# Altium project CM5_GPIO.PrjPcb
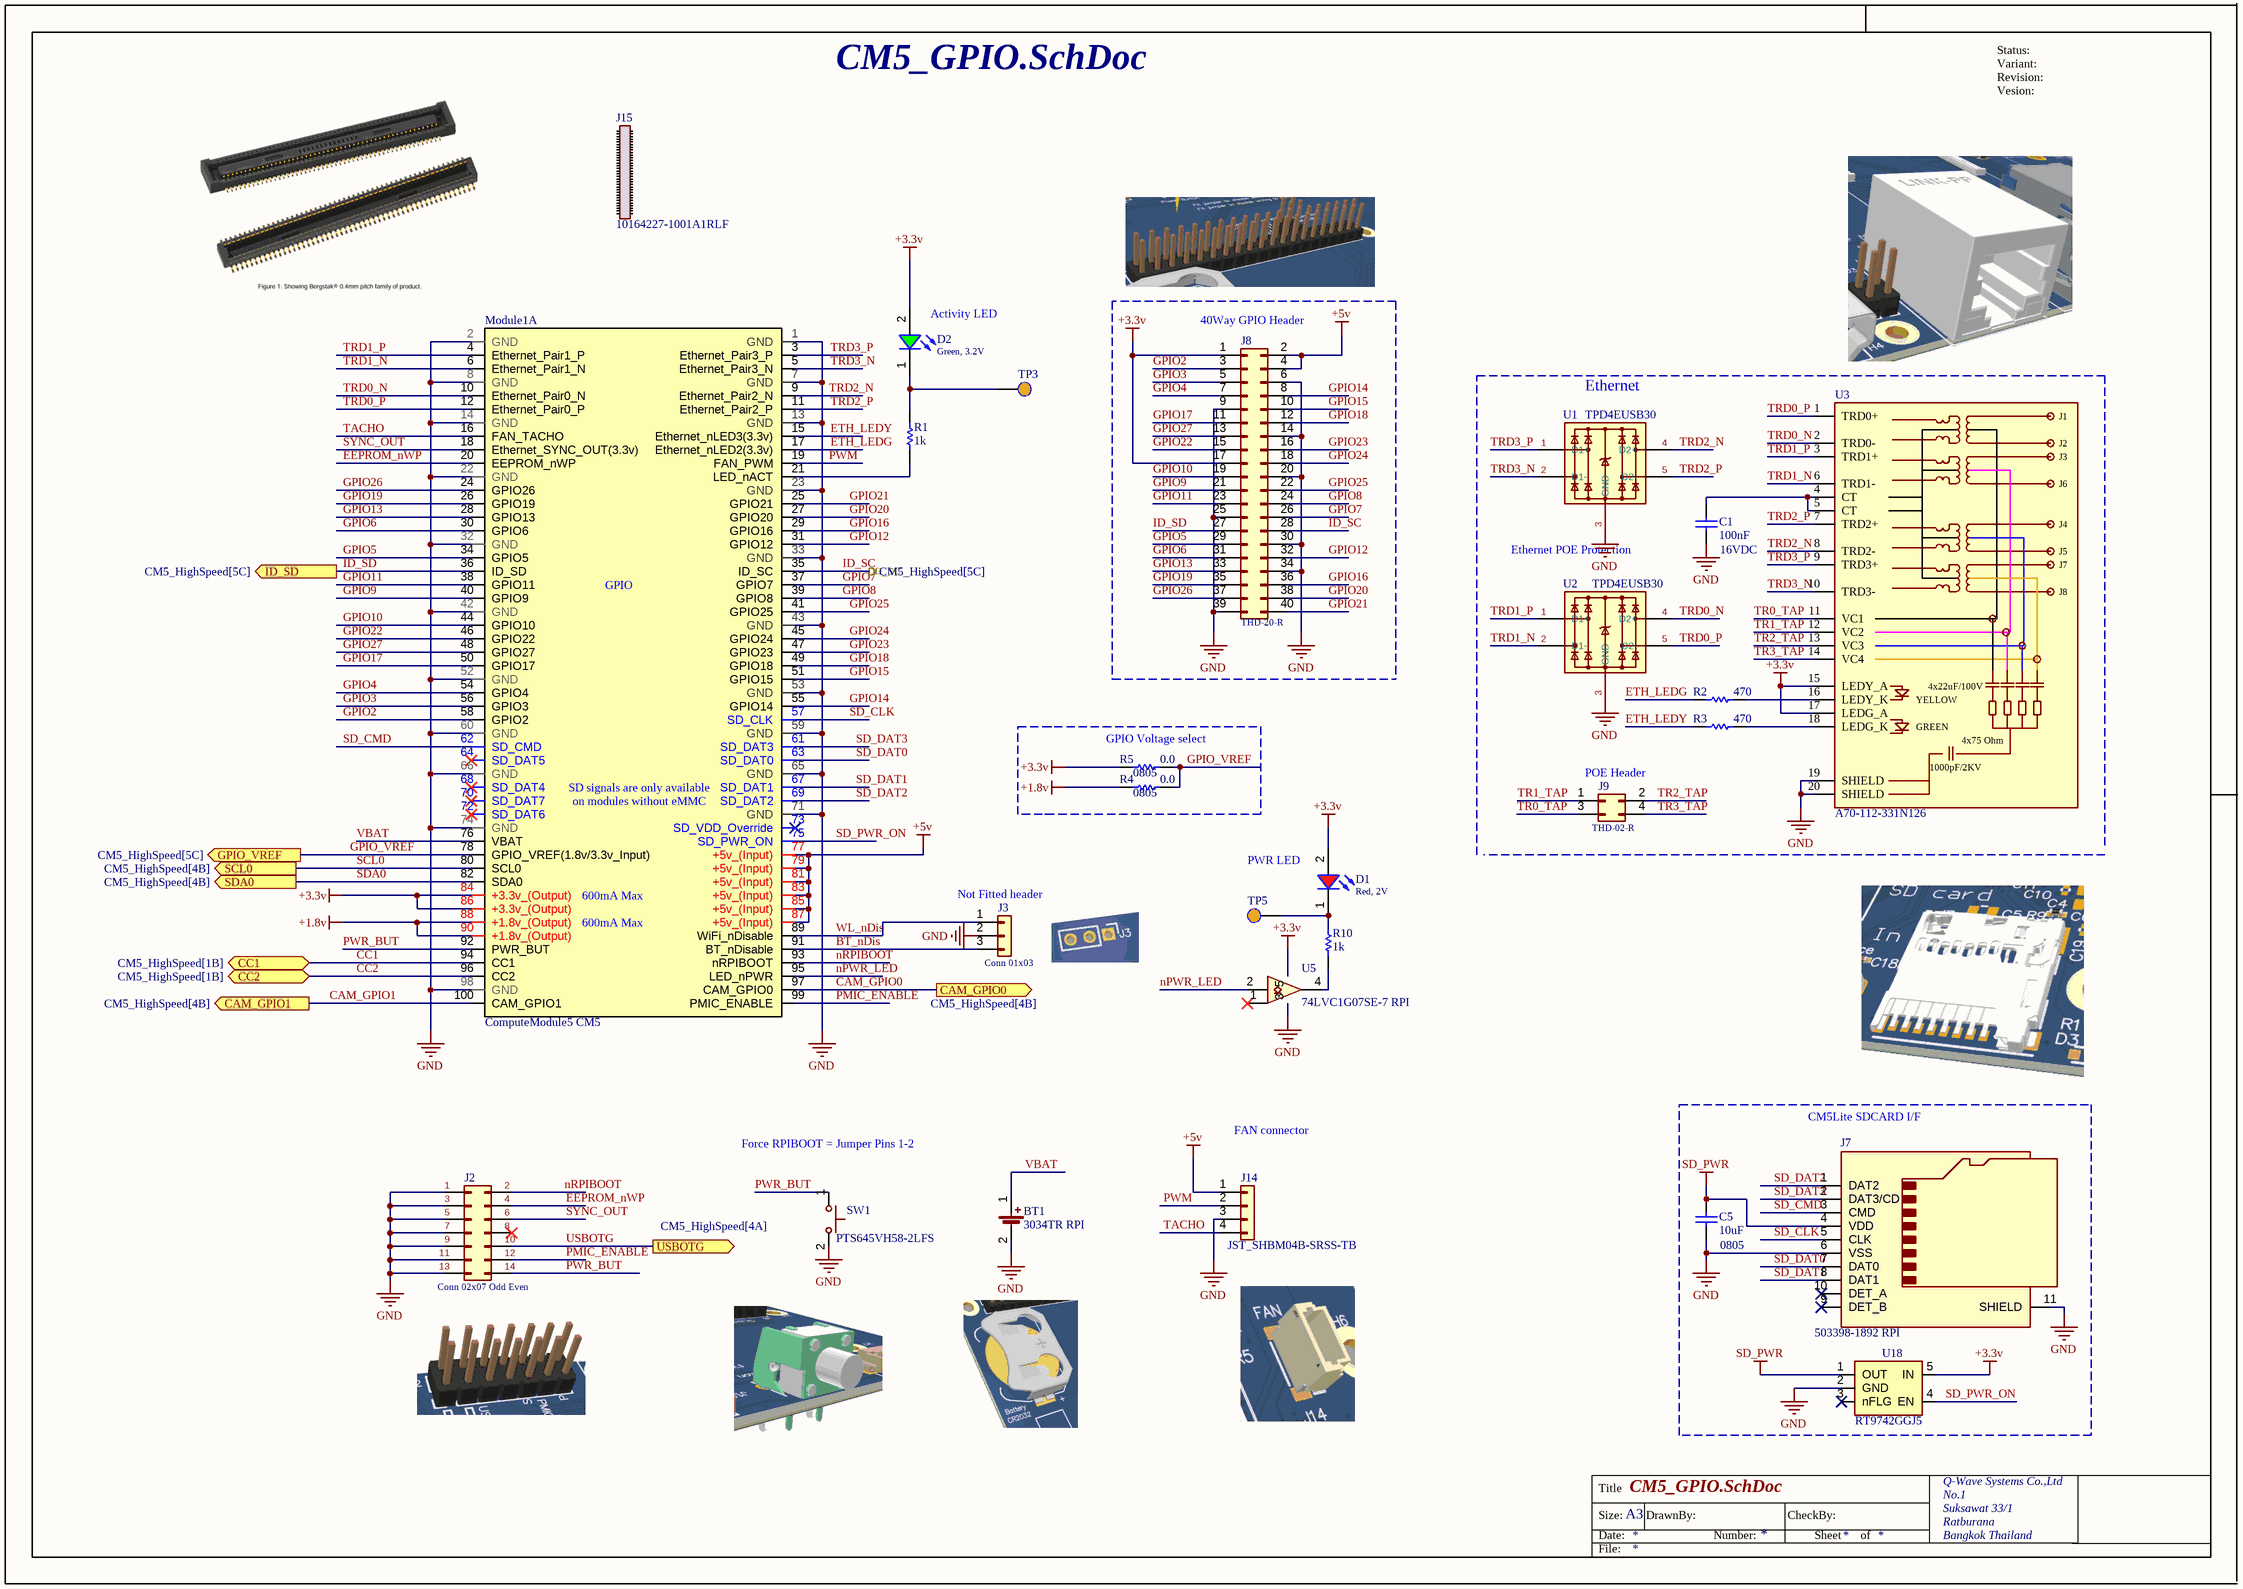
[diagram p0: CM5_GPIO.SchDoc]
3 sheets, 82 parts. Net scope: flat (ports and power ports of the same name join across sheets).
Board files: CM5IO.PcbDoc, CM5IO(1).PcbDoc
Sheets:
  CM5_GPIO.SchDoc
  CM5_HighSpeed.SchDoc
  PCIe-M2.SchDoc

## Sheet CM5_GPIO.SchDoc
size 420 x 297 mm; Organization: Q-Wave Systems Co.,Ltd; Address1: No.1; Address2: Suksawat 33/1; Address3: Ratburana; Address4: Bangkok Thailand

### Parts
BT1  3034TR RPI  [3034TR RPI]
C1  value 100nF  Rated Voltage: 16VDC  [WCAP-CSGP_0402_H=0.5mm]  (hidden comment: 100nF, 16V)
C5  value 10uF  Size: 0805  [WCAP-CSGP_0805_H=1.25mm]  (hidden comment: 10uF, 16V)
D1  Red, 2V  [WL-SMCW_0603_H=0.7mm_Red]
D2  Green, 3.2V  [WL-SMCW_0603_H=0.7mm_Green]
J2  Conn 02x07 Odd Even  [Conn 02x07 Odd Even]
J3  Conn 01x03  [Conn 01x03]
J7  503398-1892 RPI  [503398-1892 RPI]
J8  THD-20-R  [THD-20-R]
J9  THD-02-R  [THD-02-R]
J14  JST_SHBM04B-SRSS-TB  [JST_SHBM04B-SRSS-TB]
J15  10164227-1001A1RLF  [CM5-BergStak-10164227]
Module1  ComputeModule5 CM5  [ComputeModule5-CM5]  (part A of 2)  (no BOM)
R1  value 1k  [SMD-0402-RES]  (hidden comment: RES SMD 1K OHM 1% 1/10W 0402)
R2  value 470  [SMD-0402-RES]  (hidden comment: RES SMD 470 OHM 1% 1/10W 0402)
R3  value 470  [SMD-0402-RES]  (hidden comment: RES SMD 470 OHM 1% 1/10W 0402)
R4  value 0.0  Supplier Device Package: 0805  [SMD-0805-RES]  (hidden comment: ERJ-6GEY0R00V)
R5  value 0.0  Supplier Device Package: 0805  [SMD-0805-RES]  (hidden comment: ERJ-6GEY0R00V)
R10  value 1k  [SMD-0402-RES]  (hidden comment: RES SMD 1K OHM 1% 1/10W 0402)
SW1  PTS645VH58-2LFS  [PTS645VH58-2LFS]
TP3  TEST_POINT 1  [TEST_POINT 1]  (value not drawn)  (no BOM)
TP5  TEST_POINT 1  [TEST_POINT 1]  (value not drawn)  (no BOM)
U1  TPD4EUSB30  [TPD4EUSB30]
U2  TPD4EUSB30  [TPD4EUSB30]
U3  A70-112-331N126  [A70-112-331N126]
U5  74LVC1G07SE-7 RPI  [74LVC1G07SE-7 RPI]
U18  RT9742GGJ5  [FP-RT9742GGJ5-IPC_A]

### Blocks framed on the sheet
40Way GPIO Header: J8
GPIO Voltage select: R4 R5
CM5Lite SDCARD I/F: C5 J7 U18

### Ports
CAM_GPIO0 (out, see CM5_HighSpeed[4B]), CAM_GPIO1 (out, see CM5_HighSpeed[4B]), CC1 (bidir, see CM5_HighSpeed[1B]), CC2 (bidir, see CM5_HighSpeed[1B]), GPIO_VREF (out, see CM5_HighSpeed[5C]), ID_SC (out, see CM5_HighSpeed[5C]), ID_SD (out, see CM5_HighSpeed[5C]), SCL0 (out, see CM5_HighSpeed[4B]), SDA0 (out, see CM5_HighSpeed[4B]), USBOTG (out, see CM5_HighSpeed[4A])

### Nets
+1.8v: Module1.88(+1.8v_(Output)) Module1.90(+1.8v_(Output)) R4.1
+3.3v: D1.2(A) D2.2(A) J8.1(Pin_1) J8.17(Pin_17) Module1.84(+3.3v_(Output)) Module1.86(+3.3v_(Output)) R5.1 U3.15(LEDY_A) U3.17(LEDG_A) U5.5(VCC) U18.5(IN)
+5v: J8.2(Pin_2) J8.4(Pin_4) J14.1(Pin_1) Module1.77(+5v_(Input)) Module1.79(+5v_(Input)) Module1.81(+5v_(Input)) Module1.83(+5v_(Input)) Module1.85(+5v_(Input)) Module1.87(+5v_(Input))
GND: BT1.2(-) C1.1 C5.1 J2.1(Pin_1) J2.3(Pin_3) J2.5(Pin_5) J2.7(Pin_7) J2.9(Pin_9) J2.11(Pin_11) J2.13(Pin_13) J3.2(Pin_2) J7.6(VSS) J7.11(SHIELD) J8.6(Pin_6) J8.9(Pin_9) J8.14(Pin_14) J8.20(Pin_20) J8.25(Pin_25) J8.30(Pin_30) J8.34(Pin_34) J8.39(Pin_39) J14.3(Pin_3) Module1.1(GND) Module1.2(GND) Module1.7(GND) Module1.8(GND) Module1.13(GND) Module1.14(GND) Module1.22(GND) Module1.23(GND) Module1.32(GND) Module1.33(GND) Module1.42(GND) Module1.43(GND) Module1.52(GND) Module1.53(GND) Module1.59(GND) Module1.60(GND) Module1.65(GND) Module1.66(GND) Module1.71(GND) Module1.74(GND) Module1.98(GND) SW1.2 U1.3(GND) U2.3(GND) U3.19(SHIELD) U3.20(SHIELD) U5.3(GND) U18.2(GND)
SD_PWR: C5.2 J7.4(VDD) U18.1(OUT)
BT_nDis: J3.3(Pin_3) Module1.91(BT_nDisable)
CAM_GPIO0: Module1.97(CAM_GPIO0) ; port CAM_GPIO0
CAM_GPIO1: Module1.100(CAM_GPIO1) ; port CAM_GPIO1
CC1: Module1.94(CC1) ; port CC1
CC2: Module1.96(CC2) ; port CC2
EEPROM_nWP: J2.4(Pin_4) Module1.20(EEPROM_nWP)
ETH_LEDG: Module1.17(Ethernet_nLED2(3.3v)) R2.1
ETH_LEDY: Module1.15(Ethernet_nLED3(3.3v)) R3.1
GPIO2: J8.3(Pin_3) Module1.58(GPIO2)
GPIO3: J8.5(Pin_5) Module1.56(GPIO3)
GPIO4: J8.7(Pin_7) Module1.54(GPIO4)
GPIO5: J8.29(Pin_29) Module1.34(GPIO5)
GPIO6: J8.31(Pin_31) Module1.30(GPIO6)
GPIO7: J8.26(Pin_26) Module1.37(GPIO7)
GPIO8: J8.24(Pin_24) Module1.39(GPIO8)
GPIO9: J8.21(Pin_21) Module1.40(GPIO9)
GPIO10: J8.19(Pin_19) Module1.44(GPIO10)
GPIO11: J8.23(Pin_23) Module1.38(GPIO11)
GPIO12: J8.32(Pin_32) Module1.31(GPIO12)
GPIO13: J8.33(Pin_33) Module1.28(GPIO13)
GPIO14: J8.8(Pin_8) Module1.55(GPIO14)
GPIO15: J8.10(Pin_10) Module1.51(GPIO15)
GPIO16: J8.36(Pin_36) Module1.29(GPIO16)
GPIO17: J8.11(Pin_11) Module1.50(GPIO17)
GPIO18: J8.12(Pin_12) Module1.49(GPIO18)
GPIO19: J8.35(Pin_35) Module1.26(GPIO19)
GPIO20: J8.38(Pin_38) Module1.27(GPIO20)
GPIO21: J8.40(Pin_40) Module1.25(GPIO21)
GPIO22: J8.15(Pin_15) Module1.46(GPIO22)
GPIO23: J8.16(Pin_16) Module1.47(GPIO23)
GPIO24: J8.18(Pin_18) Module1.45(GPIO24)
GPIO25: J8.22(Pin_22) Module1.41(GPIO25)
GPIO26: J8.37(Pin_37) Module1.24(GPIO26)
GPIO27: J8.13(Pin_13) Module1.48(GPIO27)
GPIO_VREF: Module1.78(GPIO_VREF(1.8v/3.3v_Input)) R4.2 R5.2 ; port GPIO_VREF
ID_SC: J8.28(Pin_28) Module1.35(ID_SC) ; port ID_SC
ID_SD: J8.27(Pin_27) Module1.36(ID_SD) ; port ID_SD
nPWR_LED: Module1.95(LED_nPWR) U5.2
nRPIBOOT: J2.2(Pin_2) Module1.93(nRPIBOOT)
PMIC_ENABLE: J2.12(Pin_12) Module1.99(PMIC_ENABLE)
PWM: J14.2(Pin_2) Module1.19(FAN_PWM)
PWR_BUT: J2.14(Pin_14) Module1.92(PWR_BUT) SW1.1
SCL0: Module1.80(SCL0) ; port SCL0
SD_CLK: J7.5(CLK) Module1.57(SD_CLK)
SD_CMD: J7.3(CMD) Module1.62(SD_CMD)
SD_DAT0: J7.7(DAT0) Module1.63(SD_DAT0)
SD_DAT1: J7.8(DAT1) Module1.67(SD_DAT1)
SD_DAT2: J7.1(DAT2) Module1.69(SD_DAT2)
SD_DAT3: J7.2(DAT3/CD) Module1.61(SD_DAT3)
SD_PWR_ON: Module1.75(SD_PWR_ON) U18.4(EN)
SDA0: Module1.82(SDA0) ; port SDA0
SYNC_OUT: J2.6(Pin_6) Module1.18(Ethernet_SYNC_OUT(3.3v))
TACHO: J14.4(Pin_4) Module1.16(FAN_TACHO)
TR0_TAP: J9.3(Pin_3) U3.11(VC1)
TR1_TAP: J9.1(Pin_1) U3.12(VC2)
TR2_TAP: J9.2(Pin_2) U3.13(VC3)
TR3_TAP: J9.4(Pin_4) U3.14(VC4)
TRD0_N: Module1.10(Ethernet_Pair0_N) U2.4(D2+) U3.2(TRD0-)
TRD0_P: Module1.12(Ethernet_Pair0_P) U2.5(D2-) U3.1(TRD0+)
TRD1_N: Module1.6(Ethernet_Pair1_N) U2.2(D1-) U3.6(TRD1-)
TRD1_P: Module1.4(Ethernet_Pair1_P) U2.1(D1+) U3.3(TRD1+)
TRD2_N: Module1.9(Ethernet_Pair2_N) U1.4(D2+) U3.8(TRD2-)
TRD2_P: Module1.11(Ethernet_Pair2_P) U1.5(D2-) U3.7(TRD2+)
TRD3_N: Module1.5(Ethernet_Pair3_N) U1.2(D1-) U3.10(TRD3-)
TRD3_P: Module1.3(Ethernet_Pair3_P) U1.1(D1+) U3.9(TRD3+)
USBOTG: J2.10(Pin_10) ; port USBOTG
VBAT: BT1.1(+) Module1.76(VBAT)
WL_nDis: J3.1(Pin_1) Module1.89(WiFi_nDisable)
NetC1_2: C1.2 U3.4(CT) U3.5(CT)
NetD1_1: D1.1(K) R10.2 TP5.1
NetD2_1: D2.1(K) R1.2 TP3.1
NetModule1_21: Module1.21(LED_nACT) R1.1
NetR2_2: R2.2 U3.16(LEDY_K)
NetR3_2: R3.2 U3.18(LEDG_K)
NetR10_1: R10.1 U5.4

Not connected (* = marked no-connect by the designer): J2 8(Pin_8)*; J7 9(DET_B)* 10(DET_A)*; Module1 64(SD_DAT5)* 68(SD_DAT4)* 70(SD_DAT7)* 72(SD_DAT6)* 73(SD_VDD_Override)*; U5 1(nc)*; U18 3(nFLG)*

### Notes on the sheet
- (near D2) Activity LED
- Ethernet
- Ethernet POE
  Protection
- (near J9) POE Header
- PWR LED
- (near J3) Not Fitted header
- FAN connector
- Force RPIBOOT = Jumper Pins 1-2
- Status:
- Revision:
- Variant:
- Vesion:
- Title
- Size:
- Date:
- A3
- DrawnBy:
- Number:
- CheckBy:
- Sheet
- of
- File:
- (in symbol CMP-002-00168-2) J1; J2; J3; J6; J4; J5; J7; J8; 4x22uF/100V; YELLOW; GREEN; 4x75 Ohm; 1000pF/2KV
- (in symbol CMP-633-000139-6, part A) GPIO; SD signals are only available; on modules without eMMC; 600mA Max
- (in symbol ComputeModule5-CM5, part A) GPIO; NB SD signals are only available; on modules without eMMC; 600mA Max

### Library data of the parts
BT1 = CMP-00029-00004-2: Coin Cell Battery Holders COIN CELL RETAINER T APE/REEL 500PC; Number of Batteries: 1; Number of Contacts: 2; Termination: SMD/SMT; Contact Material: Nickel; Series: -; Height: 4.31mm; Case/Package: SMD/SMT; Material: Bronze; Mounting Technology: Surface Mount,PCB; Package Quantity: 500; Packaging: Tape and Reel; Lead Free: Lead Free; Contact Plating: Tin; Number of Cells: 1
C1 = CMP-01409-2: WCAP-CSGP Multilayer Ceramic Chip Capacitor, General Purpose, size 0402, X5R, 100nF, 16V; Manufacturer Part Number: 885012105016; Manufacturer: Wurth Elektronik; Technical Reference: X5R0402104M016DFCT10000; Isolation Resistance  min.: 5GOhm; Dissipation Factor max.: 5%; Capacitance Tolerance: +/-20%; Published Date: April 2021; Height: 0.5mm; Operating Temperature: -55 to +85degC; Source: WCAP-CSGP_0402.SchLib; Packaging: Tape and Reel; Q-Factor min.: -; Component Type: Standard; Capacitance: 100nF; Ceramic Type: X5R; ComponentLink1Description: Manufacturer; ComponentLink1URL: http://www.we-online.de; ComponentLink2URL: https://www.we-online.com/catalog/datasheet/885012105016.pdf; Pin Count: 2; Size: 0402; Mounting Technology: SMT; Design Item ID: 885012105016; ComponentLink2Description: Datasheet
C5 = CMP-01449-2: WCAP-CSGP Multilayer Ceramic Chip Capacitor, General Purpose, size 0805, X5R, 10uF, 16V; Manufacturer: Wurth Elektronik; Manufacturer Part Number: 885012107014; Isolation Resistance  min.: 0.01GOhm; Dissipation Factor max.: 10%; Capacitance Tolerance: +/-20%; Technical Reference: X5R0805106M016DFCT10000; Rated Voltage: 16VDC; Packaging: Tape and Reel; ComponentLink2URL: https://www.we-online.com/catalog/datasheet/885012107014.pdf; Height: 1.25mm; Source: WCAP-CSGP_0805.SchLib; Design Item ID: 885012107014; ComponentLink2Description: Datasheet; Pin Count: 2; Capacitance: 10uF; ComponentLink1URL: http://www.we-online.de; Operating Temperature: -55 to +85degC; Published Date: April 2021; Mounting Technology: SMT; Ceramic Type: X5R; ComponentLink1Description: Manufacturer; Component Type: Standard; Q-Factor min.: -
D1 = CMP-00986-4: WL-SMCW SMT Mono-color Chip LED Waterclear, size 0603, Red, 2V, 140deg; Part Number: 150060RS75000; ES P/N: 0176-0439-6; Dominant Wavelength typ.: 625nm; SM P/N: 6949-59100742; Luminous Intensity typ.: 250mcd; Peak Wavelength typ.: 630nm; Chip Technology: AlInGaP; Component Type: Standard; Packaging: Tape and Reel; Publisher: Wurth Elektronik; Operating Temperature: -40 to +85degC; Forward Voltage typ.: 2V; Value: Red, 2V; Viewing Angle: 140deg; Design Item ID: 150060RS75000; Size: 0603; ComponentLink1URL: http://www.we-online.de; Emitting Color: Red; Mounting Technology: SMT; Source: WL-SMCW_0603.SchLib; ComponentLink2URL: https://www.we-online.com/catalog/datasheet/150060RS75000.pdf; ComponentLink2Description: Datasheet; ComponentLink1Description: Manufacturer; Pin Count: 2; Published Date: December 2019
D2 = CMP-00983-5: WL-SMCW SMT Mono-color Chip LED Waterclear, size 0603, Green, 3.2V, 140deg; Part Number: 150060GS75000; SM P/N: 59100121; Peak Wavelength typ.: 515nm; ES P/N: 0176-1070-9; Luminous Intensity typ.: 430mcd; Chip Technology: InGaN; Dominant Wavelength typ.: 525nm; Pin Count: 2; Forward Voltage typ.: 3.2V; Viewing Angle: 140deg; Packaging: Tape and Reel; Emitting Color: Green; Publisher: Wurth Elektronik; ComponentLink1URL: http://www.we-online.de; Source: WL-SMCW_0603.SchLib; ComponentLink2URL: https://www.we-online.com/catalog/datasheet/150060GS75000.pdf; ComponentLink2Description: Datasheet; Operating Temperature: -40 to +85degC; Design Item ID: 150060GS75000; Size: 0603; Mounting Technology: SMT; Published Date: December 2019; Value: Green, 3.2V; ComponentLink1Description: Manufacturer; Component Type: Standard
J2 = CMP-002-00171-1: PinHeader 2x07 P2.54mm Vertical; Manufacturer: Wurth Elektronik; Manufacturer Part Number: 61301421121; Pitch: 2.54mm; Pin Number: 14; Working Voltage: 250VAC; Contact Resistance: 20mOhm; Row Number: Dual; Withstanding Voltage: 500VAC; Value: 14; Rated Current: 3A; Design Item ID: 61301421121; Orientation: Vertical; Operating Temperature: -40 to +105degC; Gender: Pin Header; Component Type: Standard; ComponentLink2Description: Datasheet; Source: WR-PHD_Pin Header_2.54mm.SchLib; ComponentLink2URL: https://www.we-online.com/catalog/datasheet/61301421121.pdf; ComponentLink1URL: http://www.we-online.de; Mounting Technology: THT; Packaging: Bag; ComponentLink1Description: Manufacturer; Published Date: May 2020; Pin Count: 14
J3 = CMP-002-00173-1: PinHeader_1x03_P2.54mm_Vertical; Manufacturer: Wurth Elektronik; Manufacturer Part Number: 61300311121; Row Number: Single; Contact Resistance: 20mOhm; Value: 3; Rated Current: 3A; Pitch: 2.54mm; Working Voltage: 250VAC; Withstanding Voltage: 500VAC; Component Type: Standard; Design Item ID: 61300311121; Gender: Pin Header; Published Date: May 2020; ComponentLink1URL: http://www.we-online.de; Orientation: Vertical; Source: WR-PHD_Pin Header_2.54mm.SchLib; Operating Temperature: -40 to +105degC; Pin Count: 3; Pin Number: 3; ComponentLink1Description: Manufacturer; Packaging: Bag; Mounting Technology: THT; ComponentLink2Description: Datasheet; ComponentLink2URL: https://www.we-online.com/catalog/datasheet/61300311121.pdf
J7 = CMP-002-00170-1: 1.10mm Pitch microSD Memory Card Connector, Normal Mount Surface Mount, Push-Push Type, 1.28mm Height; Number of Circuits: 8; Voltage Rating (AC): 10V; Gender: Male; Current Rating: 500mA; Pitch: 1.1mm; Depth: 14.05mm; Number of Rows: 1; Max Operating Temperature: 85°C; Packaging: Tape and Reel; Housing Material: Thermoplastic; Orientation: Right Angle; Min Operating Temperature: -25°C; Mounting Technology: Surface Mount; Series: 503398; Halogen Free: Low Halogen; Reach SVHC Compliant: Unknown; Contact Material: Bronze,Stainless Steel; Package Quantity: 2400; Number of Contacts: 8; RoHS Compliant: Yes; Termination: Solder; Width: 14.05mm; Contact Plating: Gold; Length: 13.6mm
J8 = CMP-002-00167-3: Through hole straight pin header, 2x20, 2.54mm pitch, double rows; Manufacturer Part Number: 61304021121; Manufacturer: Wurth Elektronik; Working Voltage: 250VAC; Withstanding Voltage: 500VAC; Value: 40; Row Number: Dual; Contact Resistance: 20mOhm; Rated Current: 3A; Packaging: Bag; ComponentLink1URL: http://www.we-online.de; Pitch: 2.54mm; Gender: Pin Header; Component Type: Standard; Operating Temperature: -40 to +105degC; Pin Number: 40; Source: WR-PHD_Pin Header_2.54mm.SchLib; Mounting Technology: THT; ComponentLink1Description: Manufacturer; Orientation: Vertical; Pin Count: 40; Published Date: May 2020; ComponentLink2Description: Datasheet; ComponentLink2URL: https://www.we-online.com/catalog/datasheet/61304021121.pdf; Design Item ID: 61304021121
J9 = CMP-002-00174-1: PinHeader 2x02 P2.54mm Vertical; Manufacturer: Wurth Elektronik; Manufacturer Part Number: 61300421121; Rated Current: 3A; Pin Number: 4; Row Number: Dual; Withstanding Voltage: 500VAC; Pitch: 2.54mm; Contact Resistance: 20mOhm; Working Voltage: 250VAC; Value: 4; Gender: Pin Header; Published Date: May 2020; ComponentLink1Description: Manufacturer; Mounting Technology: THT; Orientation: Vertical; ComponentLink1URL: http://www.we-online.de; ComponentLink2Description: Datasheet; Pin Count: 4; ComponentLink2URL: https://www.we-online.com/catalog/datasheet/61300421121.pdf; Operating Temperature: -40 to +105degC; Component Type: Standard; Packaging: Bag; Source: WR-PHD_Pin Header_2.54mm.SchLib; Design Item ID: 61300421121
J14 = CMP-002-00172-1: Board Connector, 4 Contact(s), 1 Row(s), Male, Straight, Surface Mount Terminal; Pitch: 0.039inch; Number of Contacts: 4; Series: SR; Lead Free: Contains Lead; Housing Material: Nylon; Contact Plating: Tin,Lead; Number of Positions: 4; Contact Type: Male Pin; Contact Material: Copper Alloy; Mounting Technology: Surface Mount; Number of Rows: 1; Package Quantity: 1500; Termination: Solder; Orientation: Vertical; Housing Color: Natural; Color: Natural; Packaging: Cut Tape
J15 = CMP-634-000024-1: CM5 1.5mm Height 0.4MM Btb, 100P, Receptacle, 1.5MM Stack Height
Module1 = CMP-633-000139-6: Raspberry Pi Compute Module 5
R1 R10 = CMP-236-000247-2: Manufacturer: Panasonic Electronic Components; Part Number: ERJ-2RKF1001X; Factory Stock: 0; Unit Price (USD): 0.00496; Temperature Coefficient: ±100ppm/°C; Power (Watts): 0.1W, 1/10W; @ qty: 1500; Minimum Quantity: 1; Series: ERJ; Package / Case: 0402 (1005 Metric); Part Status: Active; Packaging: Cut Tape (CT); Number of Terminations: 2; Height - Seated (Max): 0.016" (0.40mm); Image: //media.digikey.com/Photos/Panasonic%20Photos/ERJ-PA2-Series.jpg; Quantity Available: 1787831; Datasheets: http://industrial.panasonic.com/www-cgi/jvcr13pz.cgi?E+PZ+3+AOA0002+ERJ2RKF1001X+7+WW; Failure Rate: -; Supplier Device Package: 0402; Tolerance: ±1%; Composition: Thick Film; Size / Dimension: 0.039" L x 0.020" W (1.00mm x 0.50mm); Features: Automotive AEC-Q200; Operating Temperature: -55°C ~ 155°C; Digi-Key Part Number: P1.00KLCT-ND
R2 R3 = CMP-236-000627-2: Part Number: ERJ-2RKF4700X; Manufacturer: Panasonic Electronic Components; Temperature Coefficient: ±100ppm/°C; Minimum Quantity: 1; @ qty: 1500; Unit Price (USD): 0.00496; Power (Watts): 0.1W, 1/10W; Factory Stock: 0; Packaging: Cut Tape (CT); Supplier Device Package: 0402; Part Status: Active; Series: ERJ; Features: Automotive AEC-Q200; Image: //media.digikey.com/Photos/Panasonic%20Photos/ERJ-PA2-Series.jpg; Operating Temperature: -55°C ~ 155°C; Number of Terminations: 2; Height - Seated (Max): 0.016" (0.40mm); Failure Rate: -; Digi-Key Part Number: P470LCT-ND; Tolerance: ±1%; Size / Dimension: 0.039" L x 0.020" W (1.00mm x 0.50mm); Package / Case: 0402 (1005 Metric); Datasheets: http://industrial.panasonic.com/www-cgi/jvcr13pz.cgi?E+PZ+3+AOA0002+ERJ2RKF4700X+7+WW; Quantity Available: 52644; Composition: Thick Film
R4 R5 = CMP-775-000874-3: RES SMD 0.0 OHM JUMPER 1/8W 0805; Manufacturer: Panasonic Electronic Components; @ qty: 1500; Factory Stock: 0; Unit Price (USD): 0.00544; Minimum Quantity: 1; Power (Watts): 0.125W, 1/8W; ES P/N: 0150-1835-2; Tolerance: Jumper; Source: Panasonic_ERJ_0805.SchLib; Part Number: ERJ-6GEY0R00V; Datasheets: http://industrial.panasonic.com/www-cgi/jvcr13pz.cgi?E+PZ+3+AOA0001+ERJ6GEY0R00V+7+WW; Image: //media.digikey.com/Renders/Panasonic%20Renders/ERJ-0805%20Pkg.jpg; Component Type: Standard; Operating Temperature: -55?C ~ 155?C; Packaging: Cut Tape (CT); Design Item ID: ERJ-6GEY0R00V; Failure Rate: -; Composition: Thick Film; Package / Case: 0805 (2012 Metric); Quantity Available: 1597627; Series: ERJ; Pin Count: 2; Number of Terminations: 2; Part Status: Active; Temperature Coefficient: -; Size / Dimension: 0.079" L x 0.049" W (2.00mm x 1.25mm); Height - Seated (Max): 0.028" (0.70mm); Features: Automotive AEC-Q200; Digi-Key Part Number: P0.0ACT-ND
SW1 = CMP-643-000011-1: PTS645 Series Compact 6 x 6 mm SPST 2 N Through Hole Tactile Switch; Switch Function: Off-Mom; Mechanical Life: 100000Cycles; Voltage Rating (DC): 12V; Operating Force: 200gf; Actuator Material: Nylon,Polyamide,PA66; Illumination Type: Non-Illuminated,Illuminated; Actuator Type: Standard; Max Current Rating: 50mA; Size: 2.5mm; Lead Free: Lead Free; Package Quantity: 1000; Termination: PC Pin; Min Operating Temperature: -20°C; Reach SVHC Compliant: No; Contact Material: Brass,Silver; Max Operating Temperature: 60°C; Contact Plating: Silver; Length: 7.5mm; Color: Black; Packaging: Bulk; RoHS Compliant: Yes; Throw Configuration: SPST; Depth: 9.8mm; Mounting Technology: Through Hole; Series: PTS645; Current Rating: 50mA; Orientation: Right Angle
TP3 TP5 = CMP-633-000141-1: Test Point SMT PAD; Component Type: Standard (No BOM); Pin Count: 1; Design Item ID: TEST_POINT
U1 U2 = CMP-02720-1: TEXAS INSTRUMENTS         TPD4EUSB30DQAR             ESD Protection Device, Array, 8 V, SON, 10 Pins; Current Rating: 5A; ESD Protection: Yes; Peak Pulse Current: 1A; ES P/N: 0086-0901-1; SM P/N: 6949-44043002; Capacitance: 0.8pF; Breakdown Voltage: 7V; Reverse Standoff Voltage: 5.5V; Min Breakdown Voltage: 8V; Interface: USB; Data Rate: 6Gbps; Number of Bidirectional Channels: 4; Direction: Unidirectional; Peak Pulse Power: 45W; Termination: SMD/SMT; Length: 2.5mm; Radiation Hardening: No; Number of Pins: 10; Package Quantity: 1; Packaging: Tape and Reel; Height: 0.5mm; Working Voltage: 5.5V; Lead Free: Lead Free; Max Operating Temperature: 85°C; Depth: 1mm; Min Operating Temperature: -40°C; REACH SVHC: No SVHC; RoHS Compliant: Yes; Clamping Voltage: 8V; Width: 1.1mm; Number of Channels: 4; Power Line Protection: Yes
U3 = CMP-002-00168-2: TRJG0926HENL Single Port Ethernet(PoE+) RJ45 Female Connector with 10/100/1000 Base-T Integrated Magnetics, Green/Yellow LED, Tab Down, RoHS; TE P/N: 5-2337992-8; ComponentLink1Description: https://www.l-p.com/sale-432379-link-pp-lpjg0926henl-cross-a70-112-331n126-edac.htm; EDAC P/N: A70-112-331N126; ComponentLink1URL: https://www.l-p.com/upload/file/2019/11-26/002050785.pdf; ComponentLink2Description: TRXCOM; ComponentLink2URL: https://p.globalsources.com/IMAGES/PDT/SPEC/690/K1160305690.pdf
U5 = CMP-633-000142-2: 74LVC Series 5.5 V Surface Mount Single Buffer with Open Drain Output - SOT-353; Polarity: Inverting,Non-Inverting; Number of Input Lines: 1; Max Supply Voltage: 5.5V; Logic Function: Buffer,Inverting; Turn-On Delay Time: 8.5ns; Quiescent Current: 200uA; Min Supply Voltage: 1.65V; Low Level Output Current: 32mA; Propagation Delay: 3ns; Operating Supply Current: 10uA; Package Quantity: 3000; Technology: CMOS; Number of Channels: 1; Reach SVHC Compliant: No; RoHS Compliant: Yes; Case/Package: SOT-353; Mounting Technology: Surface Mount; Number of Elements: 1; Length: 2.2mm; Min Operating Temperature: -40°C; Pins: 5; Max Operating Temperature: 85°C; Number of Inputs: 1; Width: 1.35mm; Number of Gates: 1; Number of Outputs: 1; Packaging: Tape and Reel; Series: 74LVC; Number of Output Lines: 1; Lead Free: Lead Free; Number of Bits per Element: 1; Height: 1mm; Radiation Hardening: No
U18 = CMP-000462-2: IC Pwr Swtch N-chan 1: 1 TSOT23-5; Output Configuration: High Side; Max Output current: 1A; Interface: On/Off; On-State Resistance: 70mR; Fault Protection: Over Temperature,Reverse Current; Number of Outputs: 1; Series: -; Reach SVHC Compliant: No; Case/Package: SOT-23-5; Max Operating Temperature: 85°C; Min Operating Temperature: -40°C; Pins: 23; Packaging: Cut Tape; RoHS Compliant: Yes

## Sheet CM5_HighSpeed.SchDoc
size 420 x 297 mm; Organization: Q-Wave Systems Co.,Ltd; Address1: No.1; Address2: Suksawat 33/1; Address3: Ratburana; Address4: Bangkok Thailand
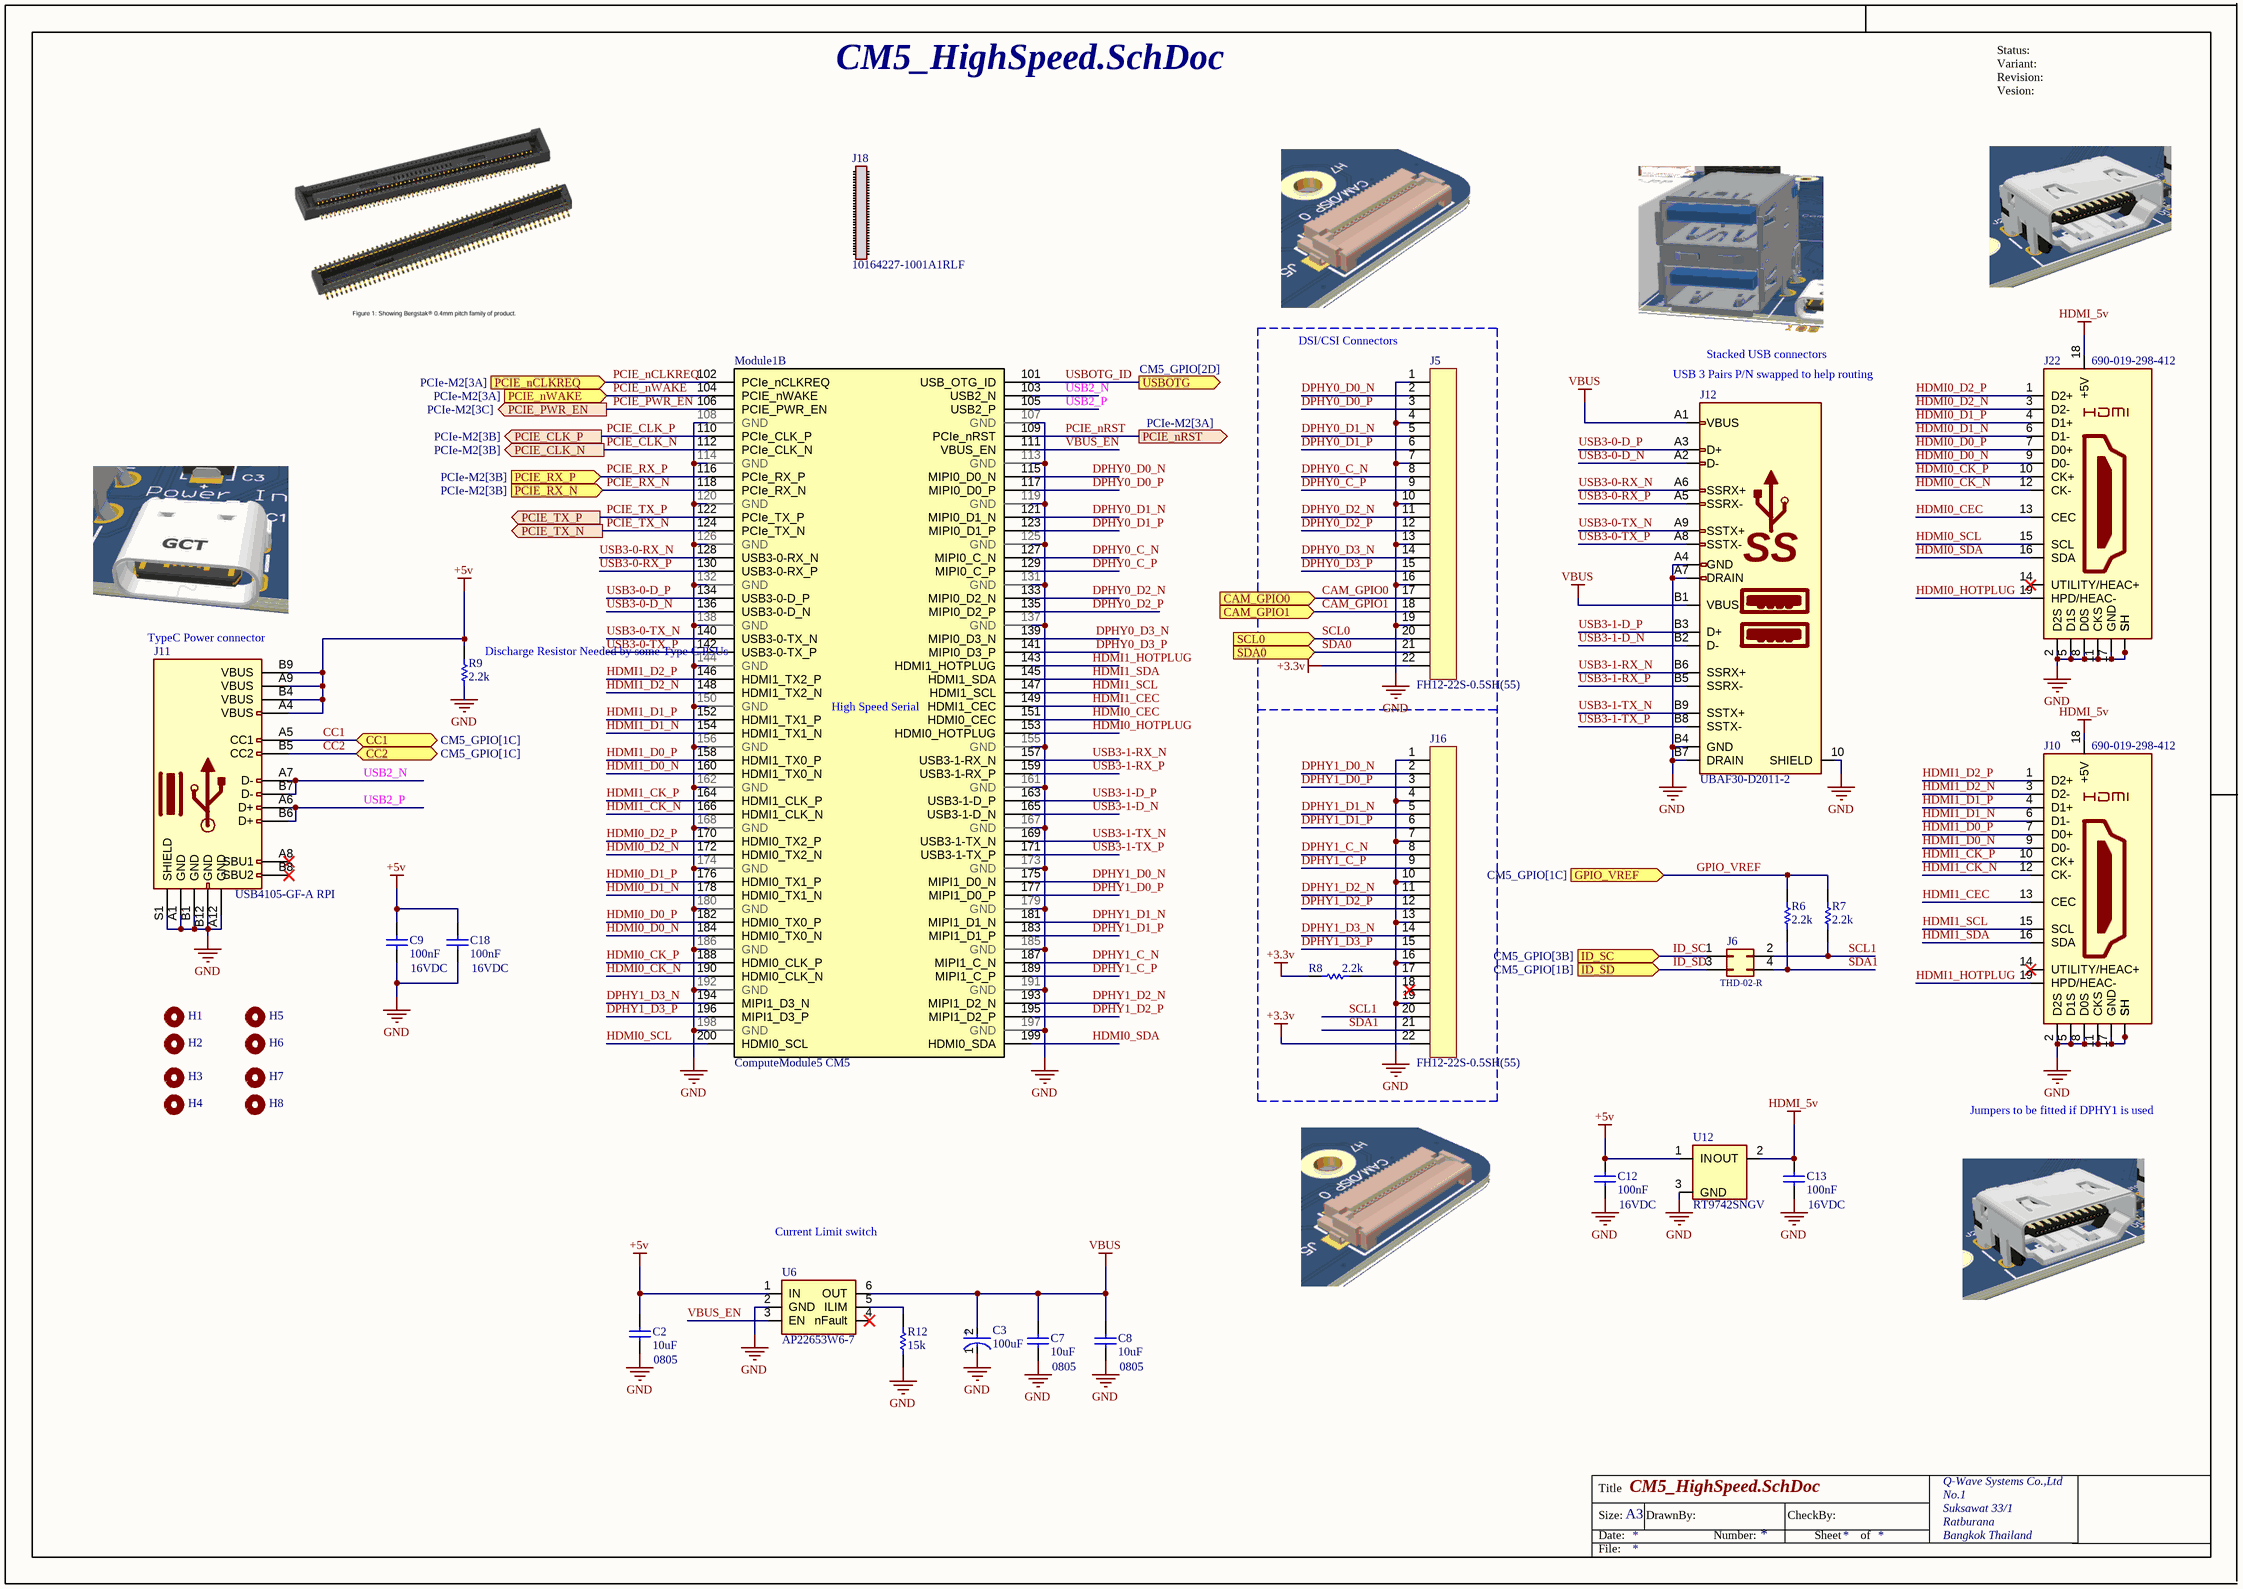
[diagram p1: CM5_HighSpeed.SchDoc]

### Parts
C2  value 10uF  Size: 0805  [WCAP-CSGP_0805_H=1.25mm]  (hidden comment: 10uF, 16V)
C3  value 100uF  [FP-CX-MFG]  (hidden comment: EEF-CX0J101R)
C7  value 10uF  Size: 0805  [WCAP-CSGP_0805_H=1.25mm]  (hidden comment: 10uF, 16V)
C8  value 10uF  Size: 0805  [WCAP-CSGP_0805_H=1.25mm]  (hidden comment: 10uF, 16V)
C9  value 100nF  Rated Voltage: 16VDC  [WCAP-CSGP_0402_H=0.5mm]  (hidden comment: 100nF, 16V)
C12  value 100nF  Rated Voltage: 16VDC  [WCAP-CSGP_0402_H=0.5mm]  (hidden comment: 100nF, 16V)
C13  value 100nF  Rated Voltage: 16VDC  [WCAP-CSGP_0402_H=0.5mm]  (hidden comment: 100nF, 16V)
C18  value 100nF  Rated Voltage: 16VDC  [WCAP-CSGP_0402_H=0.5mm]  (hidden comment: 100nF, 16V)
H1  MountingHole CMIO  [MountingHole CMIO]  (value not drawn)  (no BOM)
H2  MountingHole CMIO  [MountingHole CMIO]  (value not drawn)  (no BOM)
H3  MountingHole CMIO  [MountingHole CMIO]  (value not drawn)  (no BOM)
H4  MountingHole CMIO  [MountingHole CMIO]  (value not drawn)  (no BOM)
H5  MountingHole CMIO  [MountingHole CMIO]  (value not drawn)  (no BOM)
H6  MountingHole CMIO  [MountingHole CMIO]  (value not drawn)  (no BOM)
H7  MountingHole CMIO  [MountingHole CMIO]  (value not drawn)  (no BOM)
H8  MountingHole CMIO  [MountingHole CMIO]  (value not drawn)  (no BOM)
J5  FH12-22S-0.5SH(55)  [FH12-22S-0.5SH(55)]
J6  THD-02-R  [THD-02-R]
J10  690-019-298-412  [690-019-298-412]
J11  USB4105-GF-A RPI  [USB4105-GF-A RPI]
J12  UBAF30-D2011-2  [UBAF30-D2011-2]
J16  FH12-22S-0.5SH(55)  [FH12-22S-0.5SH(55)]
J18  10164227-1001A1RLF  [CM5-BergStak-10164227]
J22  690-019-298-412  [690-019-298-412]
Module1  ComputeModule5 CM5  [ComputeModule5-CM5]  (part B of 2)  (no BOM)
R6  value 2.2k  [SMD-0402-RES]  (hidden comment: RES SMD 2.2K OHM 1% 1/10W 0402)
R7  value 2.2k  [SMD-0402-RES]  (hidden comment: RES SMD 2.2K OHM 1% 1/10W 0402)
R8  value 2.2k  [SMD-0402-RES]  (hidden comment: RES SMD 2.2K OHM 1% 1/10W 0402)
R9  value 2.2k  [SMD-0402-RES]  (hidden comment: RES SMD 2.2K OHM 1% 1/10W 0402)
R12  value 15k  [SMD-0402-RES]  (hidden comment: RES SMD 15K OHM 1% 1/10W 0402)
U6  AP22653W6-7  [FP-SOT26-IPC_A]
U12  RT9742SNGV  [RT9742SNGV]

### Ports
CAM_GPIO0 (in, see CM5_GPIO[3C]), CAM_GPIO1 (in, see CM5_GPIO[1C]), CC1 (bidir, see CM5_GPIO[1C]), CC2 (bidir, see CM5_GPIO[1C]), GPIO_VREF (in, see CM5_GPIO[1C]), ID_SC (in, see CM5_GPIO[3B]), ID_SD (in, see CM5_GPIO[1B]), PCIE_CLK_N (out, see PCIe-M2[3B]), PCIE_CLK_P (out, see PCIe-M2[3B]), PCIE_nCLKREQ (in, see PCIe-M2[3A]), PCIE_nRST (out, see PCIe-M2[3A]), PCIE_nWAKE (in, see PCIe-M2[3A]), PCIE_PWR_EN (out, see PCIe-M2[3C]), PCIE_RX_N (in, see PCIe-M2[3B]), PCIE_RX_P (in, see PCIe-M2[3B]), PCIE_TX_N (out, see PCIe-M2[3A]), PCIE_TX_P (out, see PCIe-M2[3A]), SCL0 (in, see CM5_GPIO[1C]), SDA0 (in, see CM5_GPIO[1C]), USBOTG (out, see CM5_GPIO[2D])

### Nets
+3.3v: J5.22(Pin_22) J16.22(Pin_22) R8.1
+5v: C2.2 C9.2 C12.2 C18.2 J11.A4(VBUS) J11.A9(VBUS) J11.B4(VBUS) J11.B9(VBUS) R9.2 U6.1(IN) U12.1(IN)
GND: C2.1 C3.1(C) C7.1 C8.1 C9.1 C12.1 C13.1 C18.1 J5.1(Pin_1) J5.4(Pin_4) J5.7(Pin_7) J5.10(Pin_10) J5.13(Pin_13) J5.16(Pin_16) J5.19(Pin_19) J10.2(D2S) J10.5(D1S) J10.8(D0S) J10.11(CKS) J10.17(GND) J10.SH1(SH) J10.SH2(SH) J10.SH3(SH) J10.SH4(SH) J11.A1(GND) J11.A12(GND) J11.B1(GND) J11.B12(GND) J11.S1(SHIELD) J12.10(SHIELD) J12.A4(GND) J12.A7(DRAIN) J12.B4(GND) J12.B7(DRAIN) J16.1(Pin_1) J16.4(Pin_4) J16.7(Pin_7) J16.10(Pin_10) J16.13(Pin_13) J16.16(Pin_16) J16.19(Pin_19) J22.2(D2S) J22.5(D1S) J22.8(D0S) J22.11(CKS) J22.17(GND) J22.SH1(SH) J22.SH2(SH) J22.SH3(SH) J22.SH4(SH) Module1.107(GND) Module1.108(GND) Module1.113(GND) Module1.114(GND) Module1.119(GND) Module1.120(GND) Module1.125(GND) Module1.126(GND) Module1.131(GND) Module1.132(GND) Module1.137(GND) Module1.138(GND) Module1.144(GND) Module1.150(GND) Module1.155(GND) Module1.156(GND) Module1.161(GND) Module1.162(GND) Module1.167(GND) Module1.168(GND) Module1.173(GND) Module1.174(GND) Module1.179(GND) Module1.180(GND) Module1.185(GND) Module1.186(GND) Module1.191(GND) Module1.192(GND) Module1.197(GND) Module1.198(GND) R9.1 R12.2 U6.2(GND) U12.3(GND)
HDMI_5v: C13.2 J10.18(+5V) J22.18(+5V) U12.2(OUT)
VBUS: C3.2(A) C7.2 C8.2 J12.A1(VBUS) J12.B1(VBUS) U6.6(OUT)
CAM_GPIO0: J5.17(Pin_17) ; port CAM_GPIO0
CAM_GPIO1: J5.18(Pin_18) ; port CAM_GPIO1
CC1: J11.A5(CC1) ; port CC1
CC2: J11.B5(CC2) ; port CC2
DPHY0_C_N: J5.8(Pin_8) Module1.127(MIPI0_C_N)
DPHY0_C_P: J5.9(Pin_9) Module1.129(MIPI0_C_P)
DPHY0_D0_N: J5.2(Pin_2) Module1.115(MIPI0_D0_N)
DPHY0_D0_P: J5.3(Pin_3) Module1.117(MIPI0_D0_P)
DPHY0_D1_N: J5.5(Pin_5) Module1.121(MIPI0_D1_N)
DPHY0_D1_P: J5.6(Pin_6) Module1.123(MIPI0_D1_P)
DPHY0_D2_N: J5.11(Pin_11) Module1.133(MIPI0_D2_N)
DPHY0_D2_P: J5.12(Pin_12) Module1.135(MIPI0_D2_P)
DPHY0_D3_N: J5.14(Pin_14) Module1.139(MIPI0_D3_N)
DPHY0_D3_P: J5.15(Pin_15) Module1.141(MIPI0_D3_P)
DPHY1_C_N: J16.8(Pin_8) Module1.187(MIPI1_C_N)
DPHY1_C_P: J16.9(Pin_9) Module1.189(MIPI1_C_P)
DPHY1_D0_N: J16.2(Pin_2) Module1.175(MIPI1_D0_N)
DPHY1_D0_P: J16.3(Pin_3) Module1.177(MIPI1_D0_P)
DPHY1_D1_N: J16.5(Pin_5) Module1.181(MIPI1_D1_N)
DPHY1_D1_P: J16.6(Pin_6) Module1.183(MIPI1_D1_P)
DPHY1_D2_N: J16.11(Pin_11) Module1.193(MIPI1_D2_N)
DPHY1_D2_P: J16.12(Pin_12) Module1.195(MIPI1_D2_P)
DPHY1_D3_N: J16.14(Pin_14) Module1.194(MIPI1_D3_N)
DPHY1_D3_P: J16.15(Pin_15) Module1.196(MIPI1_D3_P)
GPIO_VREF: R6.2 R7.2 ; port GPIO_VREF
HDMI0_CEC: J22.13(CEC) Module1.151(HDMI0_CEC)
HDMI0_CK_N: J22.12(CK-) Module1.190(HDMI0_CLK_N)
HDMI0_CK_P: J22.10(CK+) Module1.188(HDMI0_CLK_P)
HDMI0_D0_N: J22.9(D0-) Module1.184(HDMI0_TX0_N)
HDMI0_D0_P: J22.7(D0+) Module1.182(HDMI0_TX0_P)
HDMI0_D1_N: J22.6(D1-) Module1.178(HDMI0_TX1_N)
HDMI0_D1_P: J22.4(D1+) Module1.176(HDMI0_TX1_P)
HDMI0_D2_N: J22.3(D2-) Module1.172(HDMI0_TX2_N)
HDMI0_D2_P: J22.1(D2+) Module1.170(HDMI0_TX2_P)
HDMI0_HOTPLUG: J22.19(HPD/HEAC-) Module1.153(HDMI0_HOTPLUG)
HDMI0_SCL: J22.15(SCL) Module1.200(HDMI0_SCL)
HDMI0_SDA: J22.16(SDA) Module1.199(HDMI0_SDA)
HDMI1_CEC: J10.13(CEC) Module1.149(HDMI1_CEC)
HDMI1_CK_N: J10.12(CK-) Module1.166(HDMI1_CLK_N)
HDMI1_CK_P: J10.10(CK+) Module1.164(HDMI1_CLK_P)
HDMI1_D0_N: J10.9(D0-) Module1.160(HDMI1_TX0_N)
HDMI1_D0_P: J10.7(D0+) Module1.158(HDMI1_TX0_P)
HDMI1_D1_N: J10.6(D1-) Module1.154(HDMI1_TX1_N)
HDMI1_D1_P: J10.4(D1+) Module1.152(HDMI1_TX1_P)
HDMI1_D2_N: J10.3(D2-) Module1.148(HDMI1_TX2_N)
HDMI1_D2_P: J10.1(D2+) Module1.146(HDMI1_TX2_P)
HDMI1_HOTPLUG: J10.19(HPD/HEAC-) Module1.143(HDMI1_HOTPLUG)
HDMI1_SCL: J10.15(SCL) Module1.147(HDMI1_SCL)
HDMI1_SDA: J10.16(SDA) Module1.145(HDMI1_SDA)
ID_SC: J6.1(Pin_1) ; port ID_SC
ID_SD: J6.3(Pin_3) ; port ID_SD
PCIE_CLK_N: Module1.112(PCIe_CLK_N) ; port PCIE_CLK_N
PCIE_CLK_P: Module1.110(PCIe_CLK_P) ; port PCIE_CLK_P
PCIE_nCLKREQ: Module1.102(PCIe_nCLKREQ) ; port PCIE_nCLKREQ
PCIE_nRST: Module1.109(PCIe_nRST) ; port PCIE_nRST
PCIE_nWAKE: Module1.104(PCIE_nWAKE) ; port PCIE_nWAKE
PCIE_PWR_EN: Module1.106(PCIE_PWR_EN) ; port PCIE_PWR_EN
PCIE_RX_N: Module1.118(PCIe_RX_N) ; port PCIE_RX_N
PCIE_RX_P: Module1.116(PCIe_RX_P) ; port PCIE_RX_P
PCIE_TX_N: Module1.124(PCIe_TX_N) ; port PCIE_TX_N
PCIE_TX_P: Module1.122(PCIe_TX_P) ; port PCIE_TX_P
SCL0: J5.20(Pin_20) ; port SCL0
SCL1: J6.2(Pin_2) J16.20(Pin_20) R7.1
SDA0: J5.21(Pin_21) ; port SDA0
SDA1: J6.4(Pin_4) J16.21(Pin_21) R6.1
USB2_N: J11.A7(D-) J11.B7(D-) Module1.103(USB2_N)
USB2_P: J11.A6(D+) J11.B6(D+) Module1.105(USB2_P)
USB3-0-D_N: J12.A2(D-) Module1.136(USB3-0-D_N)
USB3-0-D_P: J12.A3(D+) Module1.134(USB3-0-D_P)
USB3-0-RX_N: J12.A6(SSRX+) Module1.128(USB3-0-RX_N)
USB3-0-RX_P: J12.A5(SSRX-) Module1.130(USB3-0-RX_P)
USB3-0-TX_N: J12.A9(SSTX+) Module1.140(USB3-0-TX_N)
USB3-0-TX_P: J12.A8(SSTX-) Module1.142(USB3-0-TX_P)
USB3-1-D_N: J12.B2(D-) Module1.165(USB3-1-D_N)
USB3-1-D_P: J12.B3(D+) Module1.163(USB3-1-D_P)
USB3-1-RX_N: J12.B6(SSRX+) Module1.157(USB3-1-RX_N)
USB3-1-RX_P: J12.B5(SSRX-) Module1.159(USB3-1-RX_P)
USB3-1-TX_N: J12.B9(SSTX+) Module1.169(USB3-1-TX_N)
USB3-1-TX_P: J12.B8(SSTX-) Module1.171(USB3-1-TX_P)
USBOTG_ID: Module1.101(USB_OTG_ID) ; port USBOTG  [project net USBOTG]
VBUS_EN: Module1.111(VBUS_EN) U6.3(EN)
NetJ16_17: J16.17(Pin_17) R8.2
NetR12_1: R12.1 U6.5(ILIM)

Not connected (* = marked no-connect by the designer): J10 14(UTILITY/HEAC+)*; J11 A8(SBU1)* B8(SBU2)*; J16 18(Pin_18)*; J22 14(UTILITY/HEAC+)*; U6 4(nFault)*

### Notes on the sheet
- (near J5) DSI/CSI Connectors
- (near J12) USB 3 Pairs P/N swapped to help routing
- Stacked USB connectors
- (near J11) TypeC Power connector
- (near Module1) Discharge Resistor
  Needed by some
  Type C PSUs
- Jumpers to be fitted if DPHY1 is used
- Current Limit switch
- Status:
- Revision:
- Variant:
- Vesion:
- Title
- Size:
- Date:
- A3
- DrawnBy:
- Number:
- CheckBy:
- Sheet
- of
- File:
- (in symbol CMP-002-00176-3) SS
- (in symbol CMP-000464-1) +
- (in symbol CMP-633-000139-6, part B) High Speed Serial
- (in symbol ComputeModule5-CM5, part B) High Speed Serial

### Library data of the parts
C2 C7 C8 = CMP-01449-2: as C5 on sheet CM5_GPIO; Packaging: Tape and Reel; ComponentLink2URL: https://www.we-online.com/catalog/datasheet/885012107014.pdf; Height: 1.25mm; Source: WCAP-CSGP_0805.SchLib; Design Item ID: 885012107014; ComponentLink2Description: Datasheet; Pin Count: 2; Capacitance: 10uF; ComponentLink1URL: http://www.we-online.de; Operating Temperature: -55 to +85degC; Published Date: April 2021; Mounting Technology: SMT; Ceramic Type: X5R; ComponentLink1Description: Manufacturer; Component Type: Standard; Q-Factor min.: -
C3 = CMP-000464-1: Cap Aluminum 100uF 6.3V 20% (7.3 X 4.3 X 1.9mm) SMD 0.015 Ohm 2700mA 1000h 105C Embossed T/R; Leakage Current: 63uA; Lead Diameter: 2.4mm; Life (Hours): 1000Hour; Dissipation Factor: 0.06%; Ripple Current: 2.7A; ESR (Equivalent Series Resistance): 15mR; Max Operating Temperature: 105°C; Lead Free: Lead Free; RoHS Compliant: Yes; Voltage Rating: 6.3V; Depth: 4.3mm; Reach SVHC Compliant: No; Package Quantity: 3500; Tolerance: 20%; Construction: Flat; Length: 7.3mm; Pins: 2; Width: 4.3mm; Case/Package: 2917; Height: 1.9mm; Packaging: Tape and Reel; Lead Pitch: 1.3mm; Mounting Technology: Surface Mount,PCB; Voltage: 6.3V; Termination: SMD/SMT; Ripple Current (AC): 2.7A; Weight: 0.004586oz; Case Code (Metric): 7343; Radiation Hardening: No; Voltage Rating (DC): 6.3V; Series: SP-Cap CX; Min Operating Temperature: -40°C; Case Code (Imperial): 2917
C9 C12 C13 C18 = CMP-01409-2: as C1 on sheet CM5_GPIO; Published Date: April 2021; Height: 0.5mm; Operating Temperature: -55 to +85degC; Source: WCAP-CSGP_0402.SchLib; Packaging: Tape and Reel; Q-Factor min.: -; Component Type: Standard; Capacitance: 100nF; Ceramic Type: X5R; ComponentLink1Description: Manufacturer; ComponentLink1URL: http://www.we-online.de; ComponentLink2URL: https://www.we-online.com/catalog/datasheet/885012105016.pdf; Pin Count: 2; Size: 0402; Mounting Technology: SMT; Design Item ID: 885012105016; ComponentLink2Description: Datasheet
H1-H8 = CMP-00028-00023-1
J5 J16 = CMP-002-00175-3: Connectors for Connecting - 0.5/1-mm Pitch FPC/FFC - FH12 Series (HIROSE ELECTRIC); Mating Cycles: 20; Insulation Resistance: 500MR; Number of Contacts: 22; Contact Resistance: 50mR; Current Rating: 500mA; Voltage Rating: 50V; Gender: Female; Pitch: 0.5mm; Max Current Rating: 400mA; Wire/Cable Type: Straight; Contact Location: Bottom; Actuator Material: Polyphenylene; Contact Plating: Gold; Mounting Technology: Surface Mount,Horizontal; Number of Positions: 22; Max Operating Temperature: 85°C; Packaging: Tape and Reel; Package Quantity: 2000; Width: 15.1mm; Length: 15.1mm; Lead Pitch: 0.5mm; RoHS Compliant: Yes; Max Voltage Rating (AC): 50V; Depth: 5.6mm; Lead Free: Lead Free; Series: FH12; Reach SVHC Compliant: No; Radiation Hardening: No; Material: Polyamide; Orientation: Right Angle; Contact Material: Bronze; Min Operating Temperature: -40°C; Housing Color: Beige; Flammability Rating: UL94 V-0; Number of Rows: 1; Color: Beige,Brown; Voltage Rating (AC): 50V; Housing Material: Polyamide; Termination: Solder
J6 = CMP-002-00174-1: as J9 on sheet CM5_GPIO; Gender: Pin Header; Published Date: May 2020; ComponentLink1Description: Manufacturer; Mounting Technology: THT; Orientation: Vertical; ComponentLink1URL: http://www.we-online.de; ComponentLink2Description: Datasheet; Pin Count: 4; ComponentLink2URL: https://www.we-online.com/catalog/datasheet/61300421121.pdf; Operating Temperature: -40 to +105degC; Component Type: Standard; Packaging: Bag; Source: WR-PHD_Pin Header_2.54mm.SchLib; Design Item ID: 61300421121
J10 J22 = CMP-135-000008-2: Connector: HDMI; socket; PIN: 19; gold-plated; Body coating: tinned; EDAC ALT P/N: 694D119-664-011; EDAC Link: https://edac.net/series/694d
J11 = CMP-002-00177-3: Conn USB 2.0 Type C RCP 24 POS 0.3mm/0.5mm Solder RA SMD 24 Terminal 1 Port T/R; Voltage Rating: 20V; Gender: Receptacle; USB Standard: USB 2.0; Shielding: Shielded; Number of Ports: 1; Number of Contacts: 16; Mating Cycles: 10000; Contact Material: Nickel,Gold; Series: USB4105; Height: 3.46mm; Min Operating Temperature: -40°C; Max Operating Temperature: 85°C; Contact Plating: Gold; Connector Type: USB; Mounting Technology: Surface Mount,Through Hole,Horizontal; Termination: Solder; Flammability Rating: UL94 V-0; Insulation Color: Black
J12 = CMP-002-00176-3: Conn USB 3.0 Type A RCP 18 POS 2mm/2mm Solder RA Thru-Hole 18 Terminal 2 Port T/R; Number of Contacts: 18; Shielding: Shielded; Gender: Receptacle; Number of Ports: 2; USB Standard: USB 3.0; Mating Cycles: 5000; Lead Free: Lead Free; Orientation: Right Angle; Connector Type: USB; Mounting Technology: Through Hole,Horizontal; Min Operating Temperature: -55°C; Max Operating Temperature: 85°C; Series: USB1100; RoHS Compliant: Yes; Contact Material: Copper Alloy,Copper; Termination: Solder; Flammability Rating: UL94 V-0; Reach SVHC Compliant: No; Insulation Color: Blue; Contact Plating: Gold; MT Link: https://www.mtconntech.com/double-deck-usb-af-3-0-type-90-degree-dip-type-connector-product/
J18 = CMP-634-000024-1: as J15 on sheet CM5_GPIO
Module1 = CMP-633-000139-6: Raspberry Pi Compute Module 5
R6-R9 = CMP-236-000428-2: Part Number: ERJ-2RKF2201X; Manufacturer: Panasonic Electronic Components; Power (Watts): 0.1W, 1/10W; Factory Stock: 0; Temperature Coefficient: ±100ppm/°C; Minimum Quantity: 1; @ qty: 1500; Unit Price (USD): 0.00496; Supplier Device Package: 0402; Height - Seated (Max): 0.016" (0.40mm); Tolerance: ±1%; Composition: Thick Film; Features: Automotive AEC-Q200; Datasheets: http://industrial.panasonic.com/www-cgi/jvcr13pz.cgi?E+PZ+3+AOA0002+ERJ2RKF2201X+7+WW; Size / Dimension: 0.039" L x 0.020" W (1.00mm x 0.50mm); Series: ERJ; Digi-Key Part Number: P2.20KLCT-ND; Image: //media.digikey.com/Photos/Panasonic%20Photos/ERJ-PA2-Series.jpg; Operating Temperature: -55°C ~ 155°C; Part Status: Active; Failure Rate: -; Quantity Available: 301785; Number of Terminations: 2; Packaging: Cut Tape (CT); Package / Case: 0402 (1005 Metric)
R12 = CMP-236-000339-2: Part Number: ERJ-2RKF1502X; Manufacturer: Panasonic Electronic Components; Unit Price (USD): 0.00496; Temperature Coefficient: ±100ppm/°C; Power (Watts): 0.1W, 1/10W; Factory Stock: 0; @ qty: 1500; Minimum Quantity: 1; Digi-Key Part Number: P15.0KLCT-ND; Package / Case: 0402 (1005 Metric); Size / Dimension: 0.039" L x 0.020" W (1.00mm x 0.50mm); Height - Seated (Max): 0.016" (0.40mm); Series: ERJ; Composition: Thick Film; Image: //media.digikey.com/Photos/Panasonic%20Photos/ERJ-PA2-Series.jpg; Supplier Device Package: 0402; Datasheets: http://industrial.panasonic.com/www-cgi/jvcr13pz.cgi?E+PZ+3+AOA0002+ERJ2RKF1502X+7+WW; Packaging: Cut Tape (CT); Features: Automotive AEC-Q200; Part Status: Active; Number of Terminations: 2; Failure Rate: -; Operating Temperature: -55°C ~ 155°C; Quantity Available: 1023884; Tolerance: ±1%
U6 = CMP-000465-1: USB Power High Side Switch Single 3V to 5.5V 2.1A 6-Pin SOT-26 T/R; Interface: On/Off; Number of Outputs: 1; Fault Protection: Over Voltage,Over Temperature,Short Circuit,Reverse Current; Output Configuration: High Side; Min Operating Temperature: -40°C; Output Current: 2.1A; Case/Package: SOT-23-6; Max Supply Voltage: 5.5V; Height: 1.4mm; Series: -; Number of Channels: 1; Max Output current: 2.1A; Min Supply Voltage: 3V; Max Operating Temperature: 85°C; Mounting Technology: Surface Mount
U12 = CMP-000463-1: IC Pwr Switch N-chan 1: 1 SOT23-3; Number of Outputs: 1; Fault Protection: Over Temperature,Reverse Current; Interface: On/Off; Output Configuration: High Side; Max Output current: 500mA; Packaging: Cut Tape; Max Operating Temperature: 85°C; Series: -; Case/Package: SOT-23-3; Min Operating Temperature: -40°C; Mounting Technology: Surface Mount; RoHS Compliant: Yes

## Sheet PCIe-M2.SchDoc
size 297 x 209 mm
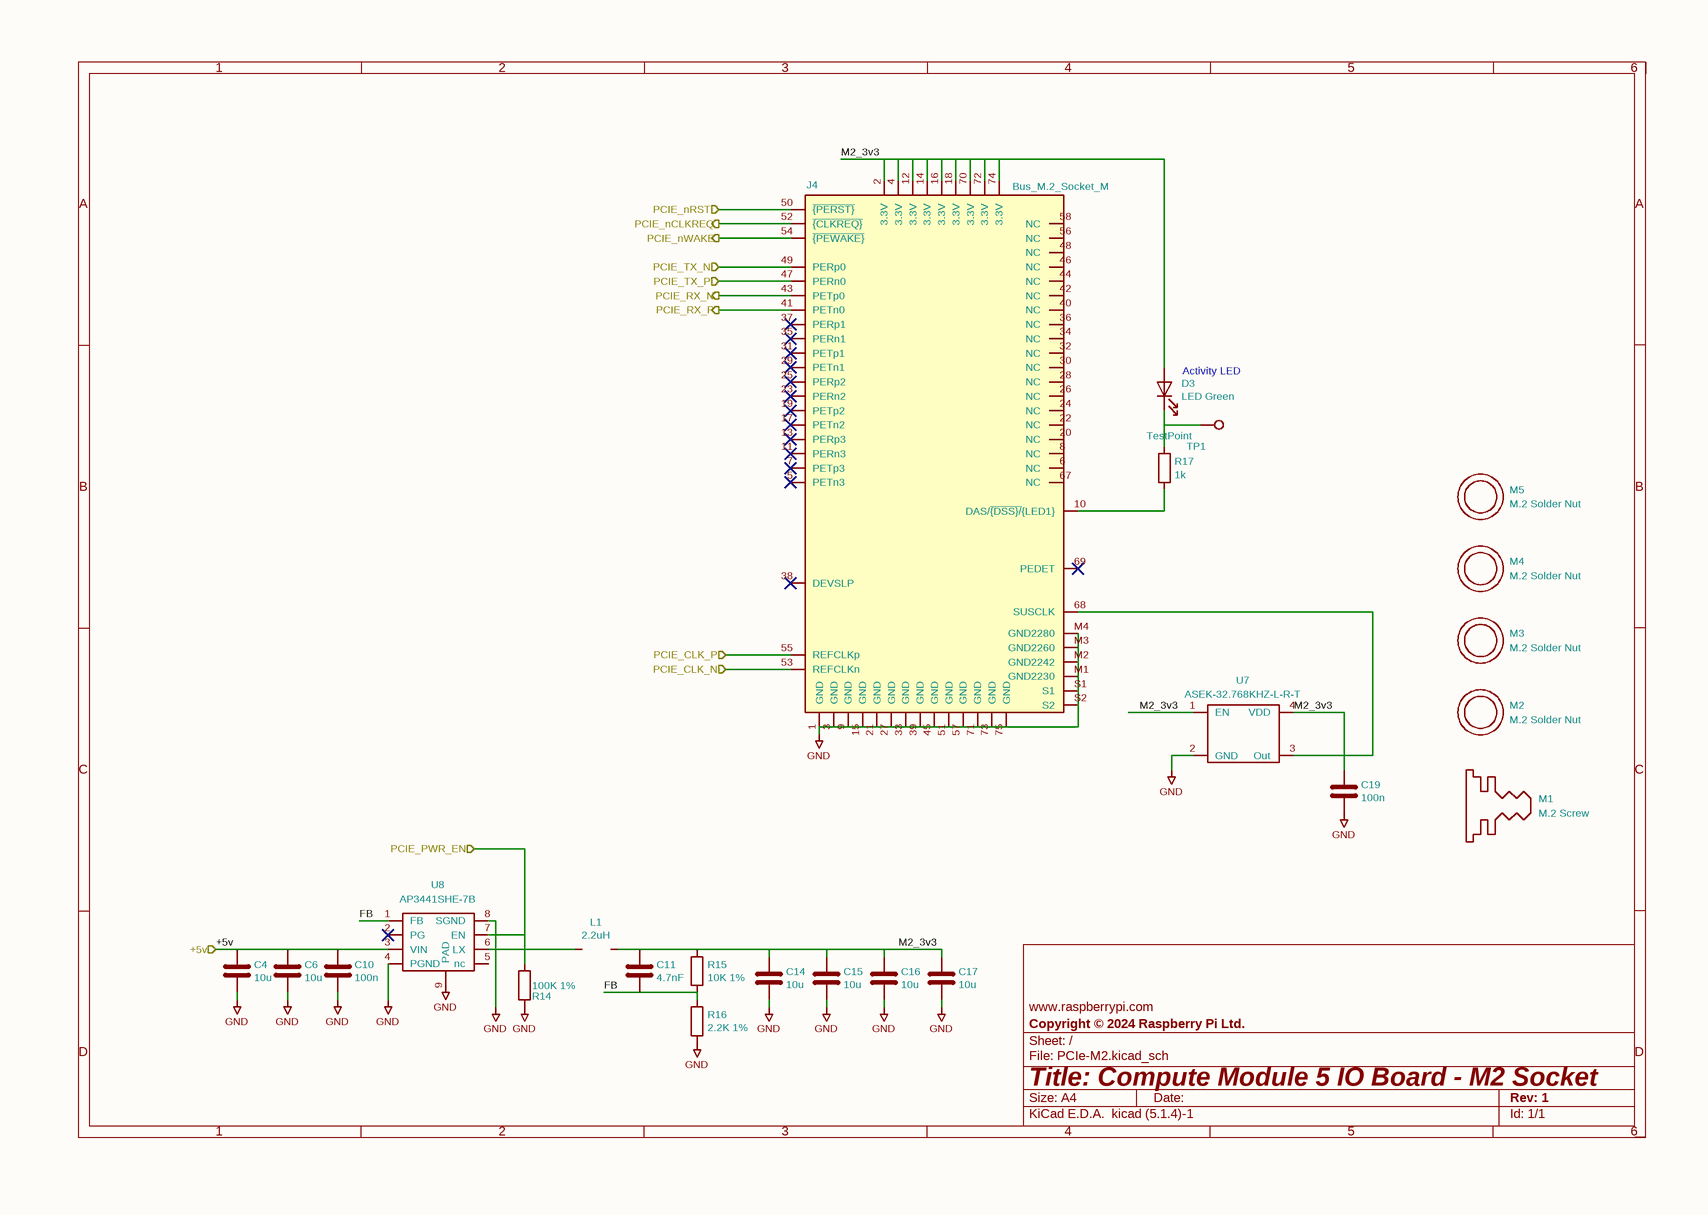
[diagram p2: PCIe-M2.SchDoc]

### Parts
C4  10u  [C_0805_2012Metric]
C6  10u  [C_0805_2012Metric]
C10  100n  [C_0402_1005Metric]
C11  4.7nF  [C_0402_1005Metric]
C14  10u  [C_0805_2012Metric]
C15  10u  [C_0805_2012Metric]
C16  10u  [C_0805_2012Metric]
C17  10u  [C_0805_2012Metric]
C19  100n  [C_0402_1005Metric]
D3  LED Green  [LED_0603_1608Metric]
J4  Bus_M.2_Socket_M  [M.2 M Key socket]
L1  2.2uH  [L_Bourns_SRP5030CC]
M1  M.2 Screw
M2  M.2 Solder Nut
M3  M.2 Solder Nut
M4  M.2 Solder Nut
M5  M.2 Solder Nut
R14  100K 1%  [R_0402_1005Metric]
R15  10K 1%  [R_0402_1005Metric]
R16  2.2K 1%  [R_0402_1005Metric]
R17  1k  [R_0402_1005Metric]
TP1  TestPoint  [TestPoint_Pad_2.0x2.0mm]
U7  ASEK-32.768KHZ-L-R-T  [Crystal_SMD_3225-4Pin_3.2x2.5mm]
U8  AP3441SHE-7B  [DFN-8-1EP_2x2mm_P0.5mm_EP1.05x1.75mm]

### Ports
+5v (in), PCIE_CLK_N (in), PCIE_CLK_P (in), PCIE_nCLKREQ (out), PCIE_nRST (in), PCIE_nWAKE (out), PCIE_PWR_EN (in), PCIE_RX_N (out), PCIE_RX_P (out), PCIE_TX_N (in), PCIE_TX_P (in)

### Nets
GND: C4.2 C6.2 C10.2 C14.2 C15.2 C16.2 C17.2 C19.2 J4.1(GND) J4.3(GND) J4.9(GND) J4.15(GND) J4.21(GND) J4.27(GND) J4.33(GND) J4.39(GND) J4.45(GND) J4.51(GND) J4.57(GND) J4.71(GND) J4.73(GND) J4.75(GND) J4.M1(GND2230) J4.M2(GND2242) J4.M3(GND2260) J4.M4(GND2280) J4.S1 J4.S2 R14.2 R16.2 U7.2(GND) U8.4(PGND) U8.8(SGND) U8.9(PAD)
+5v: C4.1 C6.1 C10.1 U8.3(VIN) ; port +5v
FB: C11.2 R15.2 R16.1 U8.1(FB)
M2_3v3: C11.1 C14.1 C15.1 C16.1 C17.1 C19.1 D3.2(A) J4.2(3.3V) J4.4(3.3V) J4.12(3.3V) J4.14(3.3V) J4.16(3.3V) J4.18(3.3V) J4.70(3.3V) J4.72(3.3V) J4.74(3.3V) L1.2 R15.1 U7.1(EN) U7.4(VDD)
PCIE_CLK_N: J4.53(REFCLKn) ; port PCIE_CLK_N
PCIE_CLK_P: J4.55(REFCLKp) ; port PCIE_CLK_P
PCIE_nCLKREQ: J4.52(~{{CLKREQ}}) ; port PCIE_nCLKREQ
PCIE_nRST: J4.50(~{{PERST}}) ; port PCIE_nRST
PCIE_nWAKE: J4.54(~{{PEWAKE}}) ; port PCIE_nWAKE
PCIE_PWR_EN: R14.1 U8.7(EN) ; port PCIE_PWR_EN
PCIE_RX_N: J4.43(PETp0) ; port PCIE_RX_N
PCIE_RX_P: J4.41(PETn0) ; port PCIE_RX_P
PCIE_TX_N: J4.49(PERp0) ; port PCIE_TX_N
PCIE_TX_P: J4.47(PERn0) ; port PCIE_TX_P
NetD3_1: D3.1(K) R17.1 TP1.1
NetJ4_10: J4.10(DAS/~{{DSS}/}{LED1}) R17.2
NetJ4_68: J4.68(SUSCLK) U7.3(Out)
NetL1_1: L1.1 U8.6(LX)

Not connected (* = marked no-connect by the designer): J4 5(PETn3)* 6(NC) 7(PETp3)* 8(NC) 11(PERn3)* 13(PERp3)* 17(PETn2)* 19(PETp2)* 20(NC) 22(NC) 23(PERn2)* 24(NC) 25(PERp2)* 26(NC) 28(NC) 29(PETn1)* 30(NC) 31(PETp1)* 32(NC) 34(NC) 35(PERn1)* 36(NC) 37(PERp1)* 38(DEVSLP)* 40(NC) 42(NC) 44(NC) 46(NC) 48(NC) 56(NC) 58(NC) 67(NC) 69(PEDET)*; U8 2(PG)* 5(nc)

### Notes on the sheet
- (near D3) Activity LED
- 1
- 2
- 3
- 4
- 5
- 6
- A
- B
- C
- www.raspberrypi.com <http://www.raspberrypi.com>
- D
- Title: Compute Module 5 IO Board - M2 Socket
- File: PCIe-M2.kicad_sch
- Sheet: /
- Copyright © 2024 Raspberry Pi Ltd.
- KiCad E.D.A.  kicad (5.1.4)-1
- Size: A4
- Date:
- Rev: 1
- Id: 1/1

### Library data of the parts
C4 C6 C14-C17 = C: Part Description: 10uF 10% 10V Ceramic Capacitor X7R 0805 (2012 Metric); Field4: Digikey; Field5: 490-14381-1-ND; Field6: GRM21BR71A106KA73L; Field7: Murata; Field8: 111893011; Value: 10u; Footprint: Capacitor_SMD:C_0805_2012Metric
C10 C19 = C: Part Description: 0.1uF 10% 16V Ceramic Capacitor X7R 0402 (1005 Metric); Field4: Farnell; Field5: 2611911; Field6: RM EMK105 B7104KV-F; Field7: TAIYO YUDEN EUROPE GMBH; Field8: 110091611; Value: 100n; Footprint: Capacitor_SMD:C_0402_1005Metric
C11 = C: Part Description: 4.7nF capacitor 0402; Value: 4.7nF; Footprint: Capacitor_SMD:C_0402_1005Metric
D3 = LED: Part Description: Green 572nm LED Indication - Discrete 2.2V 2-SMD, No Lead; Field4: Digikey; Field5: LTST-S270KGKT; Field6: SML-A12M8TT86N; Field7: Rohm; Field8: 650263301; Value: LED Green; Footprint: LED_SMD:LED_0603_1608Metric
J4 = Bus_M.2_Socket_M: Part Description: M.2 M Key connector; Description: M.2 Socket 3 Mechanical Key M; Field5: MTSSD03-67MSW337; Field7: MTCONN; Field6: MTSSD03-67MSW337; Value: Bus_M.2_Socket_M; Footprint: CM5IO:M.2 M Key socket
L1 = L: Part Description: Inductor, SMT, 2520, 2u2, IRMS=7A, ISAT=8A, DCR=0.032R; Field6: SRP5030CC-2R2M; Field7: Bourns; Field5: SRP5030CC-2R2M; Value: 2.2uH; Footprint: CM5IO:L_Bourns_SRP5030CC
M1 = M.2_Screw: Part Description: M.2 Screw; Value: M.2 Screw
M2-M5 = SolderNut: Part Description: Solder nut for M.2 slot; Value: M.2 Solder Nut
R14 = R: Part Description: Resistor 100K M1005 1% 63mW; Field4: Farnell; Field6: MCR01MZPF1003; Field7: Rohm; Value: 100K 1%; Footprint: Resistor_SMD:R_0402_1005Metric
R15 = R: Part Description: Resistor 10K M1005 1% 63mW; Field4: Farnell; Field7: Rohm; Field6: MCR01MZPF1002; Value: 10K 1%; Footprint: Resistor_SMD:R_0402_1005Metric
R16 = R: Part Description: Resistor 2.2K M1005 1% 63mW; Field4: Farnell; Value: 2.2K 1%; Footprint: Resistor_SMD:R_0402_1005Metric
R17 = R: Part Description: Resistor 1K M1005 1% 63mW; Field4: Farnell; Field5: 9239235; Field7: KOA EUROPE GMBH; Field6: RK73H1ETTP1001F; Field8: 125049511; Value: 1k; Footprint: Resistor_SMD:R_0402_1005Metric
TP1 = TestPoint: Field4: nf; Field5: nf; Field6: nf; Field7: nf; Part Description: Test point; Value: TestPoint; Footprint: TestPoint:TestPoint_Pad_2.0x2.0mm
U7 = ASEK-32.768KHZ-L-R-T: Part Description: 32KHz Xtal oscilator; Field7: abracon; Field5: ASEK-32.768KHZ-L-R-T; Field6: ASEK-32.768KHZ-L-R-T; Value: ASEK-32.768KHZ-L-R-T; Footprint: Crystal:Crystal_SMD_3225-4Pin_3.2x2.5mm
U8 = AP3441SHE-7B: Part Description: 3A DC-DC converter; Field7: Diodes; Field5: AP3441SHE-7B; Field6: AP3441SHE-7B; Value: AP3441SHE-7B; Footprint: Package_DFN_QFN:DFN-8-1EP_2x2mm_P0.5mm_EP1.05x1.75mm

## Nets that join several sheets
+3.3v: CM5_GPIO (11 pins), CM5_HighSpeed (J5.22 J16.22 R8.1)
+5v: CM5_GPIO (9 pins), CM5_HighSpeed (11 pins)
GND: CM5_GPIO (50 pins), CM5_HighSpeed (84 pins), PCIe-M2 (34 pins)
CAM_GPIO0: CM5_GPIO (Module1.97), CM5_HighSpeed (J5.17)
CAM_GPIO1: CM5_GPIO (Module1.100), CM5_HighSpeed (J5.18)
CC1: CM5_GPIO (Module1.94), CM5_HighSpeed (J11.A5)
CC2: CM5_GPIO (Module1.96), CM5_HighSpeed (J11.B5)
GPIO_VREF: CM5_GPIO (Module1.78 R4.2 R5.2), CM5_HighSpeed (R6.2 R7.2)
ID_SC: CM5_GPIO (J8.28 Module1.35), CM5_HighSpeed (J6.1)
ID_SD: CM5_GPIO (J8.27 Module1.36), CM5_HighSpeed (J6.3)
PCIE_CLK_N: CM5_HighSpeed (Module1.112), PCIe-M2 (J4.53)
PCIE_CLK_P: CM5_HighSpeed (Module1.110), PCIe-M2 (J4.55)
PCIE_nCLKREQ: CM5_HighSpeed (Module1.102), PCIe-M2 (J4.52)
PCIE_nRST: CM5_HighSpeed (Module1.109), PCIe-M2 (J4.50)
PCIE_nWAKE: CM5_HighSpeed (Module1.104), PCIe-M2 (J4.54)
PCIE_PWR_EN: CM5_HighSpeed (Module1.106), PCIe-M2 (R14.1 U8.7)
PCIE_RX_N: CM5_HighSpeed (Module1.118), PCIe-M2 (J4.43)
PCIE_RX_P: CM5_HighSpeed (Module1.116), PCIe-M2 (J4.41)
PCIE_TX_N: CM5_HighSpeed (Module1.124), PCIe-M2 (J4.49)
PCIE_TX_P: CM5_HighSpeed (Module1.122), PCIe-M2 (J4.47)
SCL0: CM5_GPIO (Module1.80), CM5_HighSpeed (J5.20)
SDA0: CM5_GPIO (Module1.82), CM5_HighSpeed (J5.21)
USBOTG: CM5_GPIO (J2.10), CM5_HighSpeed (Module1.101)